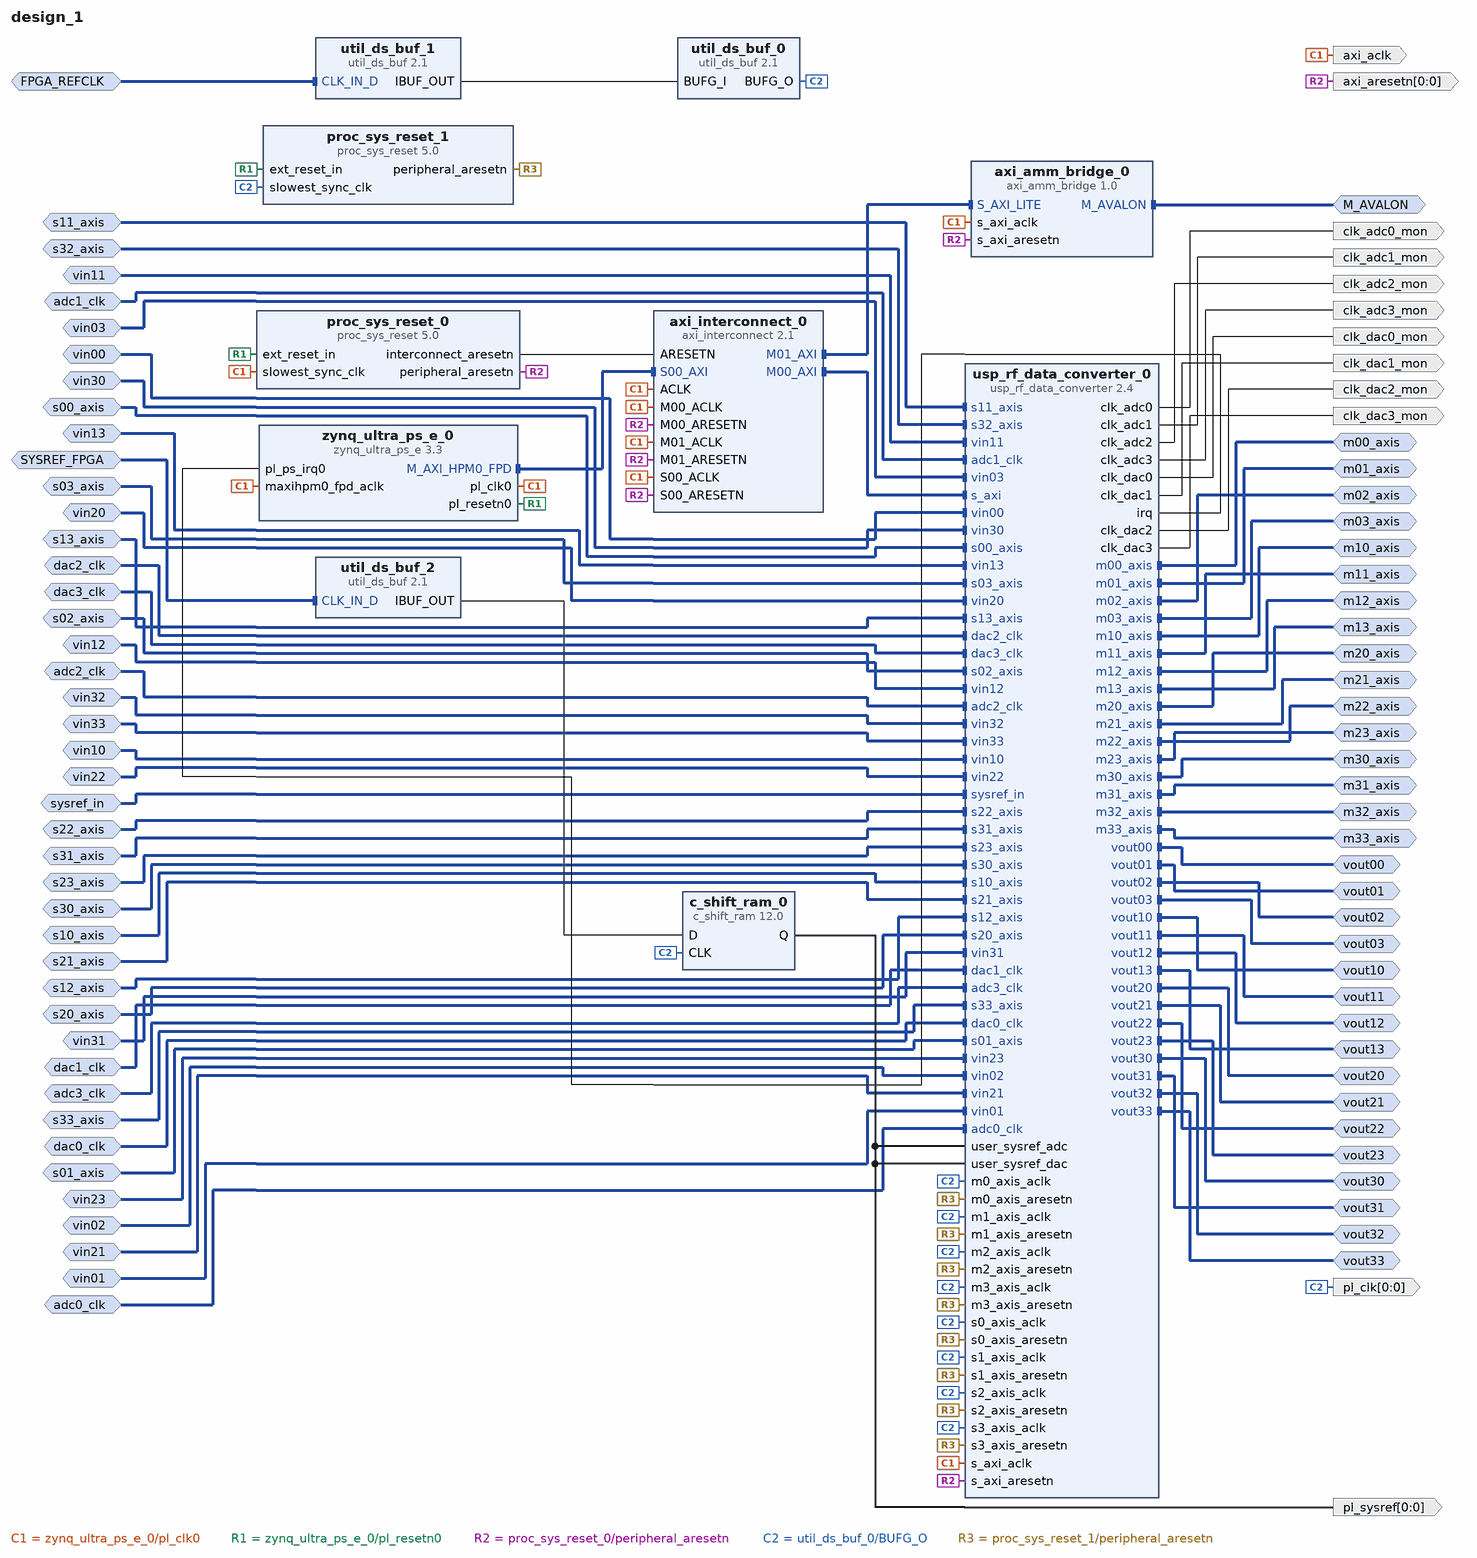
[diagram p0: block diagram of the top level]
# Vivado block design design_1, xczu49dr-ffvf1760-1-e, Vivado 2020.2
create_bd_design design_1

create_bd_intf_port -mode Master -vlnv xilinx.com:interface:avalon_rtl:1.0 M_AVALON
create_bd_intf_port -mode Master -vlnv xilinx.com:interface:diff_analog_io_rtl:1.0 vout00
create_bd_intf_port -mode Master -vlnv xilinx.com:interface:diff_analog_io_rtl:1.0 vout01
create_bd_intf_port -mode Master -vlnv xilinx.com:interface:diff_analog_io_rtl:1.0 vout02
create_bd_intf_port -mode Master -vlnv xilinx.com:interface:diff_analog_io_rtl:1.0 vout03
create_bd_intf_port -mode Master -vlnv xilinx.com:interface:diff_analog_io_rtl:1.0 vout10
create_bd_intf_port -mode Master -vlnv xilinx.com:interface:diff_analog_io_rtl:1.0 vout11
create_bd_intf_port -mode Master -vlnv xilinx.com:interface:diff_analog_io_rtl:1.0 vout12
create_bd_intf_port -mode Master -vlnv xilinx.com:interface:diff_analog_io_rtl:1.0 vout13
create_bd_intf_port -mode Master -vlnv xilinx.com:interface:diff_analog_io_rtl:1.0 vout20
create_bd_intf_port -mode Master -vlnv xilinx.com:interface:diff_analog_io_rtl:1.0 vout21
create_bd_intf_port -mode Master -vlnv xilinx.com:interface:diff_analog_io_rtl:1.0 vout22
create_bd_intf_port -mode Master -vlnv xilinx.com:interface:diff_analog_io_rtl:1.0 vout23
create_bd_intf_port -mode Master -vlnv xilinx.com:interface:diff_analog_io_rtl:1.0 vout30
create_bd_intf_port -mode Master -vlnv xilinx.com:interface:diff_analog_io_rtl:1.0 vout31
create_bd_intf_port -mode Master -vlnv xilinx.com:interface:diff_analog_io_rtl:1.0 vout32
create_bd_intf_port -mode Master -vlnv xilinx.com:interface:diff_analog_io_rtl:1.0 vout33
create_bd_intf_port -mode Slave -vlnv xilinx.com:interface:diff_clock_rtl:1.0 adc0_clk
create_bd_intf_port -mode Slave -vlnv xilinx.com:interface:diff_clock_rtl:1.0 adc1_clk
create_bd_intf_port -mode Slave -vlnv xilinx.com:interface:diff_clock_rtl:1.0 adc2_clk
create_bd_intf_port -mode Slave -vlnv xilinx.com:interface:diff_clock_rtl:1.0 adc3_clk
create_bd_intf_port -mode Slave -vlnv xilinx.com:interface:diff_clock_rtl:1.0 dac0_clk
create_bd_intf_port -mode Slave -vlnv xilinx.com:interface:diff_clock_rtl:1.0 dac1_clk
create_bd_intf_port -mode Slave -vlnv xilinx.com:interface:diff_clock_rtl:1.0 dac2_clk
create_bd_intf_port -mode Slave -vlnv xilinx.com:interface:diff_clock_rtl:1.0 dac3_clk
create_bd_intf_port -mode Slave -vlnv xilinx.com:interface:diff_analog_io_rtl:1.0 vin00
create_bd_intf_port -mode Slave -vlnv xilinx.com:interface:diff_analog_io_rtl:1.0 vin01
create_bd_intf_port -mode Slave -vlnv xilinx.com:interface:diff_analog_io_rtl:1.0 vin02
create_bd_intf_port -mode Slave -vlnv xilinx.com:interface:diff_analog_io_rtl:1.0 vin03
create_bd_intf_port -mode Slave -vlnv xilinx.com:interface:diff_analog_io_rtl:1.0 vin10
create_bd_intf_port -mode Slave -vlnv xilinx.com:interface:diff_analog_io_rtl:1.0 vin11
create_bd_intf_port -mode Slave -vlnv xilinx.com:interface:diff_analog_io_rtl:1.0 vin12
create_bd_intf_port -mode Slave -vlnv xilinx.com:interface:diff_analog_io_rtl:1.0 vin13
create_bd_intf_port -mode Slave -vlnv xilinx.com:interface:diff_analog_io_rtl:1.0 vin20
create_bd_intf_port -mode Slave -vlnv xilinx.com:interface:diff_analog_io_rtl:1.0 vin21
create_bd_intf_port -mode Slave -vlnv xilinx.com:interface:diff_analog_io_rtl:1.0 vin22
create_bd_intf_port -mode Slave -vlnv xilinx.com:interface:diff_analog_io_rtl:1.0 vin23
create_bd_intf_port -mode Slave -vlnv xilinx.com:interface:diff_analog_io_rtl:1.0 vin30
create_bd_intf_port -mode Slave -vlnv xilinx.com:interface:diff_analog_io_rtl:1.0 vin31
create_bd_intf_port -mode Slave -vlnv xilinx.com:interface:diff_analog_io_rtl:1.0 vin32
create_bd_intf_port -mode Slave -vlnv xilinx.com:interface:diff_analog_io_rtl:1.0 vin33
create_bd_intf_port -mode Slave -vlnv xilinx.com:display_usp_rf_data_converter:diff_pins_rtl:1.0 sysref_in
create_bd_intf_port -mode Slave -vlnv xilinx.com:interface:diff_clock_rtl:1.0 FPGA_REFCLK
set_property -dict {CONFIG.FREQ_HZ 245760000} [get_bd_intf_ports FPGA_REFCLK]
create_bd_intf_port -mode Slave -vlnv xilinx.com:interface:diff_clock_rtl:1.0 SYSREF_FPGA
create_bd_intf_port -mode Master -vlnv xilinx.com:interface:axis_rtl:1.0 m00_axis
set_property -dict {CONFIG.FREQ_HZ 245760000} [get_bd_intf_ports m00_axis]
create_bd_intf_port -mode Master -vlnv xilinx.com:interface:axis_rtl:1.0 m01_axis
set_property -dict {CONFIG.FREQ_HZ 245760000} [get_bd_intf_ports m01_axis]
create_bd_intf_port -mode Master -vlnv xilinx.com:interface:axis_rtl:1.0 m02_axis
set_property -dict {CONFIG.FREQ_HZ 245760000} [get_bd_intf_ports m02_axis]
create_bd_intf_port -mode Master -vlnv xilinx.com:interface:axis_rtl:1.0 m03_axis
set_property -dict {CONFIG.FREQ_HZ 245760000} [get_bd_intf_ports m03_axis]
create_bd_intf_port -mode Master -vlnv xilinx.com:interface:axis_rtl:1.0 m10_axis
set_property -dict {CONFIG.FREQ_HZ 245760000} [get_bd_intf_ports m10_axis]
create_bd_intf_port -mode Master -vlnv xilinx.com:interface:axis_rtl:1.0 m11_axis
set_property -dict {CONFIG.FREQ_HZ 245760000} [get_bd_intf_ports m11_axis]
create_bd_intf_port -mode Master -vlnv xilinx.com:interface:axis_rtl:1.0 m12_axis
set_property -dict {CONFIG.FREQ_HZ 245760000} [get_bd_intf_ports m12_axis]
create_bd_intf_port -mode Master -vlnv xilinx.com:interface:axis_rtl:1.0 m13_axis
set_property -dict {CONFIG.FREQ_HZ 245760000} [get_bd_intf_ports m13_axis]
create_bd_intf_port -mode Master -vlnv xilinx.com:interface:axis_rtl:1.0 m20_axis
set_property -dict {CONFIG.FREQ_HZ 245760000} [get_bd_intf_ports m20_axis]
create_bd_intf_port -mode Master -vlnv xilinx.com:interface:axis_rtl:1.0 m21_axis
set_property -dict {CONFIG.FREQ_HZ 245760000} [get_bd_intf_ports m21_axis]
create_bd_intf_port -mode Master -vlnv xilinx.com:interface:axis_rtl:1.0 m22_axis
set_property -dict {CONFIG.FREQ_HZ 245760000} [get_bd_intf_ports m22_axis]
create_bd_intf_port -mode Master -vlnv xilinx.com:interface:axis_rtl:1.0 m23_axis
set_property -dict {CONFIG.FREQ_HZ 245760000} [get_bd_intf_ports m23_axis]
create_bd_intf_port -mode Master -vlnv xilinx.com:interface:axis_rtl:1.0 m30_axis
set_property -dict {CONFIG.FREQ_HZ 245760000} [get_bd_intf_ports m30_axis]
create_bd_intf_port -mode Master -vlnv xilinx.com:interface:axis_rtl:1.0 m31_axis
set_property -dict {CONFIG.FREQ_HZ 245760000} [get_bd_intf_ports m31_axis]
create_bd_intf_port -mode Master -vlnv xilinx.com:interface:axis_rtl:1.0 m32_axis
set_property -dict {CONFIG.FREQ_HZ 245760000} [get_bd_intf_ports m32_axis]
create_bd_intf_port -mode Master -vlnv xilinx.com:interface:axis_rtl:1.0 m33_axis
set_property -dict {CONFIG.FREQ_HZ 245760000} [get_bd_intf_ports m33_axis]
create_bd_intf_port -mode Slave -vlnv xilinx.com:interface:axis_rtl:1.0 s00_axis
set_property -dict [list \
  CONFIG.FREQ_HZ 245760000 \
  CONFIG.HAS_TKEEP 0 \
  CONFIG.HAS_TLAST 0 \
  CONFIG.HAS_TREADY 1 \
  CONFIG.HAS_TSTRB 0 \
  CONFIG.LAYERED_METADATA undef \
  CONFIG.TDATA_NUM_BYTES 16 \
  CONFIG.TDEST_WIDTH 0 \
  CONFIG.TID_WIDTH 0 \
  CONFIG.TUSER_WIDTH 0 \
] [get_bd_intf_ports s00_axis]
create_bd_intf_port -mode Slave -vlnv xilinx.com:interface:axis_rtl:1.0 s01_axis
set_property -dict [list \
  CONFIG.FREQ_HZ 245760000 \
  CONFIG.HAS_TKEEP 0 \
  CONFIG.HAS_TLAST 0 \
  CONFIG.HAS_TREADY 1 \
  CONFIG.HAS_TSTRB 0 \
  CONFIG.LAYERED_METADATA undef \
  CONFIG.TDATA_NUM_BYTES 16 \
  CONFIG.TDEST_WIDTH 0 \
  CONFIG.TID_WIDTH 0 \
  CONFIG.TUSER_WIDTH 0 \
] [get_bd_intf_ports s01_axis]
create_bd_intf_port -mode Slave -vlnv xilinx.com:interface:axis_rtl:1.0 s02_axis
set_property -dict [list \
  CONFIG.FREQ_HZ 245760000 \
  CONFIG.HAS_TKEEP 0 \
  CONFIG.HAS_TLAST 0 \
  CONFIG.HAS_TREADY 1 \
  CONFIG.HAS_TSTRB 0 \
  CONFIG.LAYERED_METADATA undef \
  CONFIG.TDATA_NUM_BYTES 16 \
  CONFIG.TDEST_WIDTH 0 \
  CONFIG.TID_WIDTH 0 \
  CONFIG.TUSER_WIDTH 0 \
] [get_bd_intf_ports s02_axis]
create_bd_intf_port -mode Slave -vlnv xilinx.com:interface:axis_rtl:1.0 s03_axis
set_property -dict [list \
  CONFIG.FREQ_HZ 245760000 \
  CONFIG.HAS_TKEEP 0 \
  CONFIG.HAS_TLAST 0 \
  CONFIG.HAS_TREADY 1 \
  CONFIG.HAS_TSTRB 0 \
  CONFIG.LAYERED_METADATA undef \
  CONFIG.TDATA_NUM_BYTES 16 \
  CONFIG.TDEST_WIDTH 0 \
  CONFIG.TID_WIDTH 0 \
  CONFIG.TUSER_WIDTH 0 \
] [get_bd_intf_ports s03_axis]
create_bd_intf_port -mode Slave -vlnv xilinx.com:interface:axis_rtl:1.0 s10_axis
set_property -dict [list \
  CONFIG.FREQ_HZ 245760000 \
  CONFIG.HAS_TKEEP 0 \
  CONFIG.HAS_TLAST 0 \
  CONFIG.HAS_TREADY 1 \
  CONFIG.HAS_TSTRB 0 \
  CONFIG.LAYERED_METADATA undef \
  CONFIG.TDATA_NUM_BYTES 16 \
  CONFIG.TDEST_WIDTH 0 \
  CONFIG.TID_WIDTH 0 \
  CONFIG.TUSER_WIDTH 0 \
] [get_bd_intf_ports s10_axis]
create_bd_intf_port -mode Slave -vlnv xilinx.com:interface:axis_rtl:1.0 s11_axis
set_property -dict [list \
  CONFIG.FREQ_HZ 245760000 \
  CONFIG.HAS_TKEEP 0 \
  CONFIG.HAS_TLAST 0 \
  CONFIG.HAS_TREADY 1 \
  CONFIG.HAS_TSTRB 0 \
  CONFIG.LAYERED_METADATA undef \
  CONFIG.TDATA_NUM_BYTES 16 \
  CONFIG.TDEST_WIDTH 0 \
  CONFIG.TID_WIDTH 0 \
  CONFIG.TUSER_WIDTH 0 \
] [get_bd_intf_ports s11_axis]
create_bd_intf_port -mode Slave -vlnv xilinx.com:interface:axis_rtl:1.0 s12_axis
set_property -dict [list \
  CONFIG.FREQ_HZ 245760000 \
  CONFIG.HAS_TKEEP 0 \
  CONFIG.HAS_TLAST 0 \
  CONFIG.HAS_TREADY 1 \
  CONFIG.HAS_TSTRB 0 \
  CONFIG.LAYERED_METADATA undef \
  CONFIG.TDATA_NUM_BYTES 16 \
  CONFIG.TDEST_WIDTH 0 \
  CONFIG.TID_WIDTH 0 \
  CONFIG.TUSER_WIDTH 0 \
] [get_bd_intf_ports s12_axis]
create_bd_intf_port -mode Slave -vlnv xilinx.com:interface:axis_rtl:1.0 s13_axis
set_property -dict [list \
  CONFIG.FREQ_HZ 245760000 \
  CONFIG.HAS_TKEEP 0 \
  CONFIG.HAS_TLAST 0 \
  CONFIG.HAS_TREADY 1 \
  CONFIG.HAS_TSTRB 0 \
  CONFIG.LAYERED_METADATA undef \
  CONFIG.TDATA_NUM_BYTES 16 \
  CONFIG.TDEST_WIDTH 0 \
  CONFIG.TID_WIDTH 0 \
  CONFIG.TUSER_WIDTH 0 \
] [get_bd_intf_ports s13_axis]
create_bd_intf_port -mode Slave -vlnv xilinx.com:interface:axis_rtl:1.0 s20_axis
set_property -dict [list \
  CONFIG.FREQ_HZ 245760000 \
  CONFIG.HAS_TKEEP 0 \
  CONFIG.HAS_TLAST 0 \
  CONFIG.HAS_TREADY 1 \
  CONFIG.HAS_TSTRB 0 \
  CONFIG.LAYERED_METADATA undef \
  CONFIG.TDATA_NUM_BYTES 16 \
  CONFIG.TDEST_WIDTH 0 \
  CONFIG.TID_WIDTH 0 \
  CONFIG.TUSER_WIDTH 0 \
] [get_bd_intf_ports s20_axis]
create_bd_intf_port -mode Slave -vlnv xilinx.com:interface:axis_rtl:1.0 s21_axis
set_property -dict [list \
  CONFIG.FREQ_HZ 245760000 \
  CONFIG.HAS_TKEEP 0 \
  CONFIG.HAS_TLAST 0 \
  CONFIG.HAS_TREADY 1 \
  CONFIG.HAS_TSTRB 0 \
  CONFIG.LAYERED_METADATA undef \
  CONFIG.TDATA_NUM_BYTES 16 \
  CONFIG.TDEST_WIDTH 0 \
  CONFIG.TID_WIDTH 0 \
  CONFIG.TUSER_WIDTH 0 \
] [get_bd_intf_ports s21_axis]
create_bd_intf_port -mode Slave -vlnv xilinx.com:interface:axis_rtl:1.0 s22_axis
set_property -dict [list \
  CONFIG.FREQ_HZ 245760000 \
  CONFIG.HAS_TKEEP 0 \
  CONFIG.HAS_TLAST 0 \
  CONFIG.HAS_TREADY 1 \
  CONFIG.HAS_TSTRB 0 \
  CONFIG.LAYERED_METADATA undef \
  CONFIG.TDATA_NUM_BYTES 16 \
  CONFIG.TDEST_WIDTH 0 \
  CONFIG.TID_WIDTH 0 \
  CONFIG.TUSER_WIDTH 0 \
] [get_bd_intf_ports s22_axis]
create_bd_intf_port -mode Slave -vlnv xilinx.com:interface:axis_rtl:1.0 s23_axis
set_property -dict [list \
  CONFIG.FREQ_HZ 245760000 \
  CONFIG.HAS_TKEEP 0 \
  CONFIG.HAS_TLAST 0 \
  CONFIG.HAS_TREADY 1 \
  CONFIG.HAS_TSTRB 0 \
  CONFIG.LAYERED_METADATA undef \
  CONFIG.TDATA_NUM_BYTES 16 \
  CONFIG.TDEST_WIDTH 0 \
  CONFIG.TID_WIDTH 0 \
  CONFIG.TUSER_WIDTH 0 \
] [get_bd_intf_ports s23_axis]
create_bd_intf_port -mode Slave -vlnv xilinx.com:interface:axis_rtl:1.0 s30_axis
set_property -dict [list \
  CONFIG.FREQ_HZ 245760000 \
  CONFIG.HAS_TKEEP 0 \
  CONFIG.HAS_TLAST 0 \
  CONFIG.HAS_TREADY 1 \
  CONFIG.HAS_TSTRB 0 \
  CONFIG.LAYERED_METADATA undef \
  CONFIG.TDATA_NUM_BYTES 16 \
  CONFIG.TDEST_WIDTH 0 \
  CONFIG.TID_WIDTH 0 \
  CONFIG.TUSER_WIDTH 0 \
] [get_bd_intf_ports s30_axis]
create_bd_intf_port -mode Slave -vlnv xilinx.com:interface:axis_rtl:1.0 s31_axis
set_property -dict [list \
  CONFIG.FREQ_HZ 245760000 \
  CONFIG.HAS_TKEEP 0 \
  CONFIG.HAS_TLAST 0 \
  CONFIG.HAS_TREADY 1 \
  CONFIG.HAS_TSTRB 0 \
  CONFIG.LAYERED_METADATA undef \
  CONFIG.TDATA_NUM_BYTES 16 \
  CONFIG.TDEST_WIDTH 0 \
  CONFIG.TID_WIDTH 0 \
  CONFIG.TUSER_WIDTH 0 \
] [get_bd_intf_ports s31_axis]
create_bd_intf_port -mode Slave -vlnv xilinx.com:interface:axis_rtl:1.0 s32_axis
set_property -dict [list \
  CONFIG.FREQ_HZ 245760000 \
  CONFIG.HAS_TKEEP 0 \
  CONFIG.HAS_TLAST 0 \
  CONFIG.HAS_TREADY 1 \
  CONFIG.HAS_TSTRB 0 \
  CONFIG.LAYERED_METADATA undef \
  CONFIG.TDATA_NUM_BYTES 16 \
  CONFIG.TDEST_WIDTH 0 \
  CONFIG.TID_WIDTH 0 \
  CONFIG.TUSER_WIDTH 0 \
] [get_bd_intf_ports s32_axis]
create_bd_intf_port -mode Slave -vlnv xilinx.com:interface:axis_rtl:1.0 s33_axis
set_property -dict [list \
  CONFIG.FREQ_HZ 245760000 \
  CONFIG.HAS_TKEEP 0 \
  CONFIG.HAS_TLAST 0 \
  CONFIG.HAS_TREADY 1 \
  CONFIG.HAS_TSTRB 0 \
  CONFIG.LAYERED_METADATA undef \
  CONFIG.TDATA_NUM_BYTES 16 \
  CONFIG.TDEST_WIDTH 0 \
  CONFIG.TID_WIDTH 0 \
  CONFIG.TUSER_WIDTH 0 \
] [get_bd_intf_ports s33_axis]
create_bd_port -dir O -type clk axi_aclk
create_bd_port -dir O -from 0 -to 0 -type rst axi_aresetn
create_bd_port -dir O -from 0 -to 0 -type data pl_sysref
create_bd_port -dir O -type clk clk_adc0_mon
set_property -dict {CONFIG.FREQ_HZ 245760000} [get_bd_ports clk_adc0_mon]
create_bd_port -dir O -type clk clk_adc1_mon
set_property -dict {CONFIG.FREQ_HZ 245760000} [get_bd_ports clk_adc1_mon]
create_bd_port -dir O -type clk clk_adc2_mon
set_property -dict {CONFIG.FREQ_HZ 245760000} [get_bd_ports clk_adc2_mon]
create_bd_port -dir O -type clk clk_adc3_mon
set_property -dict {CONFIG.FREQ_HZ 245760000} [get_bd_ports clk_adc3_mon]
create_bd_port -dir O -type clk clk_dac0_mon
set_property -dict {CONFIG.FREQ_HZ 245760000} [get_bd_ports clk_dac0_mon]
create_bd_port -dir O -type clk clk_dac1_mon
set_property -dict {CONFIG.FREQ_HZ 245760000} [get_bd_ports clk_dac1_mon]
create_bd_port -dir O -type clk clk_dac2_mon
set_property -dict {CONFIG.FREQ_HZ 245760000} [get_bd_ports clk_dac2_mon]
create_bd_port -dir O -type clk clk_dac3_mon
set_property -dict {CONFIG.FREQ_HZ 245760000} [get_bd_ports clk_dac3_mon]
create_bd_port -dir O -from 0 -to 0 -type clk pl_clk
set_property -dict {CONFIG.FREQ_HZ 245760000} [get_bd_ports pl_clk]

create_bd_cell -type ip -vlnv xilinx.com:ip:axi_amm_bridge:1.0 axi_amm_bridge_0
set_property -dict {CONFIG.C_HAS_RESPONSE 0 CONFIG.C_USE_BYTEENABLE 0} [get_bd_cells axi_amm_bridge_0]
create_bd_cell -type ip -vlnv xilinx.com:ip:axi_interconnect:2.1 axi_interconnect_0
set_property -dict {CONFIG.NUM_MI 2} [get_bd_cells axi_interconnect_0]
create_bd_cell -type ip -vlnv xilinx.com:ip:proc_sys_reset:5.0 proc_sys_reset_0
create_bd_cell -type ip -vlnv xilinx.com:ip:zynq_ultra_ps_e:3.3 zynq_ultra_ps_e_0
set_property -dict [list \
  CONFIG.CAN0_BOARD_INTERFACE custom \
  CONFIG.CAN1_BOARD_INTERFACE custom \
  CONFIG.CSU_BOARD_INTERFACE custom \
  CONFIG.DP_BOARD_INTERFACE custom \
  CONFIG.GEM0_BOARD_INTERFACE custom \
  CONFIG.GEM1_BOARD_INTERFACE custom \
  CONFIG.GEM2_BOARD_INTERFACE custom \
  CONFIG.GEM3_BOARD_INTERFACE custom \
  CONFIG.GPIO_BOARD_INTERFACE custom \
  CONFIG.IIC0_BOARD_INTERFACE custom \
  CONFIG.IIC1_BOARD_INTERFACE custom \
  CONFIG.NAND_BOARD_INTERFACE custom \
  CONFIG.PCIE_BOARD_INTERFACE custom \
  CONFIG.PJTAG_BOARD_INTERFACE custom \
  CONFIG.PMU_BOARD_INTERFACE custom \
  CONFIG.PSU_BANK_0_IO_STANDARD LVCMOS18 \
  CONFIG.PSU_BANK_1_IO_STANDARD LVCMOS18 \
  CONFIG.PSU_BANK_2_IO_STANDARD LVCMOS18 \
  CONFIG.PSU_BANK_3_IO_STANDARD LVCMOS18 \
  CONFIG.PSU_USB3__DUAL_CLOCK_ENABLE 0 \
  CONFIG.PSU__CAN1__PERIPHERAL__ENABLE 0 \
  CONFIG.PSU__CRF_APB__ACPU_CTRL__FREQMHZ 1200 \
  CONFIG.PSU__CRF_APB__ACPU_CTRL__SRCSEL APLL \
  CONFIG.PSU__CRF_APB__APLL_CTRL__SRCSEL PSS_REF_CLK \
  CONFIG.PSU__CRF_APB__DBG_FPD_CTRL__FREQMHZ 250 \
  CONFIG.PSU__CRF_APB__DBG_FPD_CTRL__SRCSEL IOPLL \
  CONFIG.PSU__CRF_APB__DBG_TRACE_CTRL__FREQMHZ 250 \
  CONFIG.PSU__CRF_APB__DBG_TRACE_CTRL__SRCSEL IOPLL \
  CONFIG.PSU__CRF_APB__DBG_TSTMP_CTRL__FREQMHZ 250 \
  CONFIG.PSU__CRF_APB__DBG_TSTMP_CTRL__SRCSEL IOPLL \
  CONFIG.PSU__CRF_APB__DDR_CTRL__FREQMHZ 800 \
  CONFIG.PSU__CRF_APB__DDR_CTRL__SRCSEL DPLL \
  CONFIG.PSU__CRF_APB__DPDMA_REF_CTRL__FREQMHZ 600 \
  CONFIG.PSU__CRF_APB__DPDMA_REF_CTRL__SRCSEL DPLL \
  CONFIG.PSU__CRF_APB__DPLL_CTRL__SRCSEL PSS_REF_CLK \
  CONFIG.PSU__CRF_APB__DP_AUDIO_REF_CTRL__SRCSEL VPLL \
  CONFIG.PSU__CRF_APB__DP_STC_REF_CTRL__SRCSEL VPLL \
  CONFIG.PSU__CRF_APB__DP_VIDEO_REF_CTRL__SRCSEL DPLL \
  CONFIG.PSU__CRF_APB__GDMA_REF_CTRL__FREQMHZ 600 \
  CONFIG.PSU__CRF_APB__GDMA_REF_CTRL__SRCSEL DPLL \
  CONFIG.PSU__CRF_APB__GPU_REF_CTRL__FREQMHZ 600 \
  CONFIG.PSU__CRF_APB__GPU_REF_CTRL__SRCSEL DPLL \
  CONFIG.PSU__CRF_APB__TOPSW_LSBUS_CTRL__FREQMHZ 100 \
  CONFIG.PSU__CRF_APB__TOPSW_LSBUS_CTRL__SRCSEL IOPLL \
  CONFIG.PSU__CRF_APB__TOPSW_MAIN_CTRL__FREQMHZ 533.333 \
  CONFIG.PSU__CRF_APB__TOPSW_MAIN_CTRL__SRCSEL VPLL \
  CONFIG.PSU__CRF_APB__VPLL_CTRL__SRCSEL PSS_REF_CLK \
  CONFIG.PSU__CRL_APB__ADMA_REF_CTRL__FREQMHZ 500 \
  CONFIG.PSU__CRL_APB__ADMA_REF_CTRL__SRCSEL IOPLL \
  CONFIG.PSU__CRL_APB__CAN1_REF_CTRL__FREQMHZ 100 \
  CONFIG.PSU__CRL_APB__CAN1_REF_CTRL__SRCSEL IOPLL \
  CONFIG.PSU__CRL_APB__CPU_R5_CTRL__FREQMHZ 500 \
  CONFIG.PSU__CRL_APB__CPU_R5_CTRL__SRCSEL IOPLL \
  CONFIG.PSU__CRL_APB__DBG_LPD_CTRL__FREQMHZ 250 \
  CONFIG.PSU__CRL_APB__DBG_LPD_CTRL__SRCSEL IOPLL \
  CONFIG.PSU__CRL_APB__GEM3_REF_CTRL__FREQMHZ 125 \
  CONFIG.PSU__CRL_APB__GEM3_REF_CTRL__SRCSEL IOPLL \
  CONFIG.PSU__CRL_APB__I2C0_REF_CTRL__FREQMHZ 100 \
  CONFIG.PSU__CRL_APB__I2C0_REF_CTRL__SRCSEL IOPLL \
  CONFIG.PSU__CRL_APB__I2C1_REF_CTRL__FREQMHZ 100 \
  CONFIG.PSU__CRL_APB__I2C1_REF_CTRL__SRCSEL IOPLL \
  CONFIG.PSU__CRL_APB__IOPLL_CTRL__SRCSEL PSS_REF_CLK \
  CONFIG.PSU__CRL_APB__IOU_SWITCH_CTRL__FREQMHZ 250 \
  CONFIG.PSU__CRL_APB__IOU_SWITCH_CTRL__SRCSEL IOPLL \
  CONFIG.PSU__CRL_APB__LPD_LSBUS_CTRL__FREQMHZ 100 \
  CONFIG.PSU__CRL_APB__LPD_LSBUS_CTRL__SRCSEL IOPLL \
  CONFIG.PSU__CRL_APB__LPD_SWITCH_CTRL__FREQMHZ 500 \
  CONFIG.PSU__CRL_APB__LPD_SWITCH_CTRL__SRCSEL IOPLL \
  CONFIG.PSU__CRL_APB__PCAP_CTRL__FREQMHZ 200 \
  CONFIG.PSU__CRL_APB__PCAP_CTRL__SRCSEL IOPLL \
  CONFIG.PSU__CRL_APB__PL0_REF_CTRL__FREQMHZ 100 \
  CONFIG.PSU__CRL_APB__PL0_REF_CTRL__SRCSEL IOPLL \
  CONFIG.PSU__CRL_APB__QSPI_REF_CTRL__FREQMHZ 125 \
  CONFIG.PSU__CRL_APB__QSPI_REF_CTRL__SRCSEL IOPLL \
  CONFIG.PSU__CRL_APB__RPLL_CTRL__SRCSEL PSS_REF_CLK \
  CONFIG.PSU__CRL_APB__SDIO1_REF_CTRL__FREQMHZ 200 \
  CONFIG.PSU__CRL_APB__SDIO1_REF_CTRL__SRCSEL IOPLL \
  CONFIG.PSU__CRL_APB__TIMESTAMP_REF_CTRL__FREQMHZ 100 \
  CONFIG.PSU__CRL_APB__TIMESTAMP_REF_CTRL__SRCSEL IOPLL \
  CONFIG.PSU__CRL_APB__UART0_REF_CTRL__FREQMHZ 100 \
  CONFIG.PSU__CRL_APB__UART0_REF_CTRL__SRCSEL IOPLL \
  CONFIG.PSU__CRL_APB__UART1_REF_CTRL__FREQMHZ 100 \
  CONFIG.PSU__CRL_APB__UART1_REF_CTRL__SRCSEL IOPLL \
  CONFIG.PSU__CRL_APB__USB0_BUS_REF_CTRL__FREQMHZ 250 \
  CONFIG.PSU__CRL_APB__USB0_BUS_REF_CTRL__SRCSEL IOPLL \
  CONFIG.PSU__CRL_APB__USB3_DUAL_REF_CTRL__FREQMHZ 20 \
  CONFIG.PSU__CRL_APB__USB3_DUAL_REF_CTRL__SRCSEL IOPLL \
  CONFIG.PSU__CRL_APB__USB3__ENABLE 0 \
  CONFIG.PSU__CSUPMU__PERIPHERAL__VALID 1 \
  CONFIG.PSU__DDRC__BUS_WIDTH {32 Bit} \
  CONFIG.PSU__DDRC__COMPONENTS Components \
  CONFIG.PSU__DDRC__DEVICE_CAPACITY {8192 MBits} \
  CONFIG.PSU__DDRC__DRAM_WIDTH {16 Bits} \
  CONFIG.PSU__DDRC__ECC Disabled \
  CONFIG.PSU__DDRC__MEMORY_TYPE {DDR 4} \
  CONFIG.PSU__DDRC__SPEED_BIN DDR4_2400R \
  CONFIG.PSU__DDR_HIGH_ADDRESS_GUI_ENABLE 0 \
  CONFIG.PSU__DDR__INTERFACE__FREQMHZ 400.000 \
  CONFIG.PSU__DEVICE_TYPE RFSOC \
  CONFIG.PSU__DISPLAYPORT__PERIPHERAL__ENABLE 0 \
  CONFIG.PSU__DLL__ISUSED 1 \
  CONFIG.PSU__ENET0__PERIPHERAL__ENABLE 1 \
  CONFIG.PSU__ENET0__PERIPHERAL__IO {GT Lane0} \
  CONFIG.PSU__ENET3__FIFO__ENABLE 0 \
  CONFIG.PSU__ENET3__GRP_MDIO__ENABLE 0 \
  CONFIG.PSU__ENET3__PERIPHERAL__ENABLE 1 \
  CONFIG.PSU__ENET3__PERIPHERAL__IO {MIO 64 .. 75} \
  CONFIG.PSU__ENET3__PTP__ENABLE 0 \
  CONFIG.PSU__ENET3__TSU__ENABLE 0 \
  CONFIG.PSU__FPGA_PL0_ENABLE 1 \
  CONFIG.PSU__GEM0__REF_CLK_FREQ 125 \
  CONFIG.PSU__GEM0__REF_CLK_SEL {Ref Clk0} \
  CONFIG.PSU__GEM3_COHERENCY 0 \
  CONFIG.PSU__GEM3_ROUTE_THROUGH_FPD 0 \
  CONFIG.PSU__GEM__TSU__ENABLE 0 \
  CONFIG.PSU__GPIO0_MIO__IO {MIO 0 .. 25} \
  CONFIG.PSU__GPIO0_MIO__PERIPHERAL__ENABLE 1 \
  CONFIG.PSU__GPIO1_MIO__IO {MIO 26 .. 51} \
  CONFIG.PSU__GPIO1_MIO__PERIPHERAL__ENABLE 1 \
  CONFIG.PSU__GPIO2_MIO__IO {MIO 52 .. 77} \
  CONFIG.PSU__GPIO2_MIO__PERIPHERAL__ENABLE 1 \
  CONFIG.PSU__GPIO_EMIO_WIDTH 95 \
  CONFIG.PSU__GPIO_EMIO__PERIPHERAL__ENABLE 1 \
  CONFIG.PSU__GPIO_EMIO__PERIPHERAL__IO 95 \
  CONFIG.PSU__GPU_PP0__POWER__ON 0 \
  CONFIG.PSU__GPU_PP1__POWER__ON 0 \
  CONFIG.PSU__I2C0__PERIPHERAL__ENABLE 1 \
  CONFIG.PSU__I2C0__PERIPHERAL__IO {MIO 14 .. 15} \
  CONFIG.PSU__I2C1__PERIPHERAL__ENABLE 1 \
  CONFIG.PSU__I2C1__PERIPHERAL__IO {MIO 16 .. 17} \
  CONFIG.PSU__IOU_SLCR__IOU_TTC_APB_CLK__TTC0_SEL APB \
  CONFIG.PSU__IOU_SLCR__IOU_TTC_APB_CLK__TTC1_SEL APB \
  CONFIG.PSU__IOU_SLCR__IOU_TTC_APB_CLK__TTC2_SEL APB \
  CONFIG.PSU__IOU_SLCR__IOU_TTC_APB_CLK__TTC3_SEL APB \
  CONFIG.PSU__MAXIGP0__DATA_WIDTH 128 \
  CONFIG.PSU__OVERRIDE_HPX_QOS 0 \
  CONFIG.PSU__OVERRIDE__BASIC_CLOCK 0 \
  CONFIG.PSU__PMU_COHERENCY 0 \
  CONFIG.PSU__PMU__AIBACK__ENABLE 0 \
  CONFIG.PSU__PMU__EMIO_GPI__ENABLE 0 \
  CONFIG.PSU__PMU__EMIO_GPO__ENABLE 0 \
  CONFIG.PSU__PMU__GPI0__ENABLE 0 \
  CONFIG.PSU__PMU__GPI1__ENABLE 0 \
  CONFIG.PSU__PMU__GPI2__ENABLE 0 \
  CONFIG.PSU__PMU__GPI3__ENABLE 0 \
  CONFIG.PSU__PMU__GPI4__ENABLE 0 \
  CONFIG.PSU__PMU__GPI5__ENABLE 0 \
  CONFIG.PSU__PMU__GPO0__ENABLE 0 \
  CONFIG.PSU__PMU__GPO1__ENABLE 0 \
  CONFIG.PSU__PMU__GPO2__ENABLE 0 \
  CONFIG.PSU__PMU__GPO3__ENABLE 0 \
  CONFIG.PSU__PMU__GPO4__ENABLE 0 \
  CONFIG.PSU__PMU__GPO5__ENABLE 0 \
  CONFIG.PSU__PMU__PERIPHERAL__ENABLE 1 \
  CONFIG.PSU__PMU__PLERROR__ENABLE 0 \
  CONFIG.PSU__PRESET_APPLIED 0 \
  CONFIG.PSU__PSS_REF_CLK__FREQMHZ 33.333 \
  CONFIG.PSU__QSPI_COHERENCY 0 \
  CONFIG.PSU__QSPI_ROUTE_THROUGH_FPD 0 \
  CONFIG.PSU__QSPI__GRP_FBCLK__ENABLE 1 \
  CONFIG.PSU__QSPI__GRP_FBCLK__IO {MIO 6} \
  CONFIG.PSU__QSPI__PERIPHERAL__DATA_MODE x4 \
  CONFIG.PSU__QSPI__PERIPHERAL__ENABLE 1 \
  CONFIG.PSU__QSPI__PERIPHERAL__IO {MIO 0 .. 12} \
  CONFIG.PSU__QSPI__PERIPHERAL__MODE {Dual Parallel} \
  CONFIG.PSU__SATA__PERIPHERAL__ENABLE 0 \
  CONFIG.PSU__SD1_COHERENCY 0 \
  CONFIG.PSU__SD1_ROUTE_THROUGH_FPD 0 \
  CONFIG.PSU__SD1__DATA_TRANSFER_MODE 8Bit \
  CONFIG.PSU__SD1__GRP_CD__ENABLE 0 \
  CONFIG.PSU__SD1__GRP_POW__ENABLE 0 \
  CONFIG.PSU__SD1__GRP_WP__ENABLE 0 \
  CONFIG.PSU__SD1__PERIPHERAL__ENABLE 1 \
  CONFIG.PSU__SD1__PERIPHERAL__IO {MIO 39 .. 51} \
  CONFIG.PSU__SD1__SLOT_TYPE {SD 3.0} \
  CONFIG.PSU__SWDT0__CLOCK__ENABLE 0 \
  CONFIG.PSU__SWDT0__PERIPHERAL__ENABLE 1 \
  CONFIG.PSU__SWDT0__RESET__ENABLE 0 \
  CONFIG.PSU__SWDT1__CLOCK__ENABLE 0 \
  CONFIG.PSU__SWDT1__PERIPHERAL__ENABLE 1 \
  CONFIG.PSU__SWDT1__RESET__ENABLE 0 \
  CONFIG.PSU__TSU__BUFG_PORT_PAIR 0 \
  CONFIG.PSU__TTC0__CLOCK__ENABLE 0 \
  CONFIG.PSU__TTC0__PERIPHERAL__ENABLE 1 \
  CONFIG.PSU__TTC0__WAVEOUT__ENABLE 0 \
  CONFIG.PSU__TTC1__CLOCK__ENABLE 0 \
  CONFIG.PSU__TTC1__PERIPHERAL__ENABLE 1 \
  CONFIG.PSU__TTC1__WAVEOUT__ENABLE 0 \
  CONFIG.PSU__TTC2__CLOCK__ENABLE 0 \
  CONFIG.PSU__TTC2__PERIPHERAL__ENABLE 1 \
  CONFIG.PSU__TTC2__WAVEOUT__ENABLE 0 \
  CONFIG.PSU__TTC3__CLOCK__ENABLE 0 \
  CONFIG.PSU__TTC3__PERIPHERAL__ENABLE 1 \
  CONFIG.PSU__TTC3__WAVEOUT__ENABLE 0 \
  CONFIG.PSU__UART0__BAUD_RATE 115200 \
  CONFIG.PSU__UART0__MODEM__ENABLE 0 \
  CONFIG.PSU__UART0__PERIPHERAL__ENABLE 1 \
  CONFIG.PSU__UART0__PERIPHERAL__IO {MIO 18 .. 19} \
  CONFIG.PSU__UART1__PERIPHERAL__ENABLE 0 \
  CONFIG.PSU__USB0__PERIPHERAL__ENABLE 0 \
  CONFIG.PSU__USE__IRQ0 1 \
  CONFIG.PSU__USE__M_AXI_GP0 1 \
  CONFIG.PSU__USE__M_AXI_GP1 0 \
  CONFIG.PSU__USE__M_AXI_GP2 0 \
  CONFIG.QSPI_BOARD_INTERFACE custom \
  CONFIG.SATA_BOARD_INTERFACE custom \
  CONFIG.SD0_BOARD_INTERFACE custom \
  CONFIG.SD1_BOARD_INTERFACE custom \
  CONFIG.SPI0_BOARD_INTERFACE custom \
  CONFIG.SPI1_BOARD_INTERFACE custom \
  CONFIG.SUBPRESET1 Custom \
  CONFIG.SUBPRESET2 Custom \
  CONFIG.SWDT0_BOARD_INTERFACE custom \
  CONFIG.SWDT1_BOARD_INTERFACE custom \
  CONFIG.TRACE_BOARD_INTERFACE custom \
  CONFIG.TTC0_BOARD_INTERFACE custom \
  CONFIG.TTC1_BOARD_INTERFACE custom \
  CONFIG.TTC2_BOARD_INTERFACE custom \
  CONFIG.TTC3_BOARD_INTERFACE custom \
  CONFIG.UART0_BOARD_INTERFACE custom \
  CONFIG.UART1_BOARD_INTERFACE custom \
  CONFIG.USB0_BOARD_INTERFACE custom \
  CONFIG.USB1_BOARD_INTERFACE custom \
] [get_bd_cells zynq_ultra_ps_e_0]
# 779 more settings of zynq_ultra_ps_e_0 are not shown: defaults, MIO pin electricals, DDR timing, and values the tool derives
create_bd_cell -type ip -vlnv xilinx.com:ip:usp_rf_data_converter:2.4 usp_rf_data_converter_0
set_property -dict [list \
  CONFIG.ADC0_Multi_Tile_Sync true \
  CONFIG.ADC0_Outclk_Freq 245.760 \
  CONFIG.ADC0_PLL_Enable true \
  CONFIG.ADC0_Refclk_Freq 245.760 \
  CONFIG.ADC0_Sampling_Rate 1.96608 \
  CONFIG.ADC1_Multi_Tile_Sync true \
  CONFIG.ADC1_Outclk_Freq 245.760 \
  CONFIG.ADC1_PLL_Enable true \
  CONFIG.ADC1_Refclk_Freq 245.760 \
  CONFIG.ADC1_Sampling_Rate 1.96608 \
  CONFIG.ADC224_En true \
  CONFIG.ADC225_En true \
  CONFIG.ADC226_En true \
  CONFIG.ADC227_En true \
  CONFIG.ADC2_Multi_Tile_Sync true \
  CONFIG.ADC2_Outclk_Freq 245.760 \
  CONFIG.ADC2_PLL_Enable true \
  CONFIG.ADC2_Refclk_Freq 245.760 \
  CONFIG.ADC2_Sampling_Rate 1.96608 \
  CONFIG.ADC3_Multi_Tile_Sync true \
  CONFIG.ADC3_Outclk_Freq 245.760 \
  CONFIG.ADC3_PLL_Enable true \
  CONFIG.ADC3_Refclk_Freq 245.760 \
  CONFIG.ADC3_Sampling_Rate 1.96608 \
  CONFIG.ADC_Coarse_Mixer_Freq00 3 \
  CONFIG.ADC_Coarse_Mixer_Freq01 3 \
  CONFIG.ADC_Coarse_Mixer_Freq02 3 \
  CONFIG.ADC_Coarse_Mixer_Freq03 3 \
  CONFIG.ADC_Coarse_Mixer_Freq10 3 \
  CONFIG.ADC_Coarse_Mixer_Freq11 3 \
  CONFIG.ADC_Coarse_Mixer_Freq12 3 \
  CONFIG.ADC_Coarse_Mixer_Freq13 3 \
  CONFIG.ADC_Coarse_Mixer_Freq20 3 \
  CONFIG.ADC_Coarse_Mixer_Freq21 3 \
  CONFIG.ADC_Coarse_Mixer_Freq22 3 \
  CONFIG.ADC_Coarse_Mixer_Freq23 3 \
  CONFIG.ADC_Coarse_Mixer_Freq30 3 \
  CONFIG.ADC_Coarse_Mixer_Freq31 3 \
  CONFIG.ADC_Coarse_Mixer_Freq32 3 \
  CONFIG.ADC_Coarse_Mixer_Freq33 3 \
  CONFIG.ADC_Decimation_Mode00 1 \
  CONFIG.ADC_Decimation_Mode01 1 \
  CONFIG.ADC_Decimation_Mode02 1 \
  CONFIG.ADC_Decimation_Mode03 1 \
  CONFIG.ADC_Decimation_Mode10 1 \
  CONFIG.ADC_Decimation_Mode11 1 \
  CONFIG.ADC_Decimation_Mode12 1 \
  CONFIG.ADC_Decimation_Mode13 1 \
  CONFIG.ADC_Decimation_Mode20 1 \
  CONFIG.ADC_Decimation_Mode21 1 \
  CONFIG.ADC_Decimation_Mode22 1 \
  CONFIG.ADC_Decimation_Mode23 1 \
  CONFIG.ADC_Decimation_Mode30 1 \
  CONFIG.ADC_Decimation_Mode31 1 \
  CONFIG.ADC_Decimation_Mode32 1 \
  CONFIG.ADC_Decimation_Mode33 1 \
  CONFIG.ADC_Mixer_Type00 1 \
  CONFIG.ADC_Mixer_Type01 1 \
  CONFIG.ADC_Mixer_Type02 1 \
  CONFIG.ADC_Mixer_Type03 1 \
  CONFIG.ADC_Mixer_Type10 1 \
  CONFIG.ADC_Mixer_Type11 1 \
  CONFIG.ADC_Mixer_Type12 1 \
  CONFIG.ADC_Mixer_Type13 1 \
  CONFIG.ADC_Mixer_Type20 1 \
  CONFIG.ADC_Mixer_Type21 1 \
  CONFIG.ADC_Mixer_Type22 1 \
  CONFIG.ADC_Mixer_Type23 1 \
  CONFIG.ADC_Mixer_Type30 1 \
  CONFIG.ADC_Mixer_Type31 1 \
  CONFIG.ADC_Mixer_Type32 1 \
  CONFIG.ADC_Mixer_Type33 1 \
  CONFIG.ADC_OBS01 false \
  CONFIG.ADC_OBS02 false \
  CONFIG.ADC_OBS03 false \
  CONFIG.ADC_OBS11 false \
  CONFIG.ADC_OBS12 false \
  CONFIG.ADC_OBS13 false \
  CONFIG.ADC_OBS21 false \
  CONFIG.ADC_OBS22 false \
  CONFIG.ADC_OBS23 false \
  CONFIG.ADC_OBS31 false \
  CONFIG.ADC_OBS32 false \
  CONFIG.ADC_OBS33 false \
  CONFIG.ADC_Slice00_Enable true \
  CONFIG.ADC_Slice01_Enable true \
  CONFIG.ADC_Slice02_Enable true \
  CONFIG.ADC_Slice03_Enable true \
  CONFIG.ADC_Slice10_Enable true \
  CONFIG.ADC_Slice11_Enable true \
  CONFIG.ADC_Slice12_Enable true \
  CONFIG.ADC_Slice13_Enable true \
  CONFIG.ADC_Slice20_Enable true \
  CONFIG.ADC_Slice21_Enable true \
  CONFIG.ADC_Slice22_Enable true \
  CONFIG.ADC_Slice23_Enable true \
  CONFIG.ADC_Slice30_Enable true \
  CONFIG.ADC_Slice31_Enable true \
  CONFIG.ADC_Slice32_Enable true \
  CONFIG.ADC_Slice33_Enable true \
  CONFIG.Converter_Setup 1 \
  CONFIG.DAC0_Multi_Tile_Sync true \
  CONFIG.DAC0_Outclk_Freq 245.760 \
  CONFIG.DAC0_PLL_Enable true \
  CONFIG.DAC0_Refclk_Freq 245.760 \
  CONFIG.DAC0_Sampling_Rate 1.96608 \
  CONFIG.DAC1_Multi_Tile_Sync true \
  CONFIG.DAC1_Outclk_Freq 245.760 \
  CONFIG.DAC1_PLL_Enable true \
  CONFIG.DAC1_Refclk_Freq 245.760 \
  CONFIG.DAC1_Sampling_Rate 1.96608 \
  CONFIG.DAC228_En true \
  CONFIG.DAC229_En true \
  CONFIG.DAC230_En true \
  CONFIG.DAC231_En true \
  CONFIG.DAC2_Multi_Tile_Sync true \
  CONFIG.DAC2_Outclk_Freq 245.760 \
  CONFIG.DAC2_PLL_Enable true \
  CONFIG.DAC2_Refclk_Freq 245.760 \
  CONFIG.DAC2_Sampling_Rate 1.96608 \
  CONFIG.DAC3_Multi_Tile_Sync true \
  CONFIG.DAC3_Outclk_Freq 245.760 \
  CONFIG.DAC3_PLL_Enable true \
  CONFIG.DAC3_Refclk_Freq 245.760 \
  CONFIG.DAC3_Sampling_Rate 1.96608 \
  CONFIG.DAC_Coarse_Mixer_Freq00 3 \
  CONFIG.DAC_Coarse_Mixer_Freq01 3 \
  CONFIG.DAC_Coarse_Mixer_Freq02 3 \
  CONFIG.DAC_Coarse_Mixer_Freq03 3 \
  CONFIG.DAC_Coarse_Mixer_Freq10 3 \
  CONFIG.DAC_Coarse_Mixer_Freq11 3 \
  CONFIG.DAC_Coarse_Mixer_Freq12 3 \
  CONFIG.DAC_Coarse_Mixer_Freq13 3 \
  CONFIG.DAC_Coarse_Mixer_Freq20 3 \
  CONFIG.DAC_Coarse_Mixer_Freq21 3 \
  CONFIG.DAC_Coarse_Mixer_Freq22 3 \
  CONFIG.DAC_Coarse_Mixer_Freq23 3 \
  CONFIG.DAC_Coarse_Mixer_Freq30 3 \
  CONFIG.DAC_Coarse_Mixer_Freq31 3 \
  CONFIG.DAC_Coarse_Mixer_Freq32 3 \
  CONFIG.DAC_Coarse_Mixer_Freq33 3 \
  CONFIG.DAC_Data_Width00 8 \
  CONFIG.DAC_Data_Width01 8 \
  CONFIG.DAC_Data_Width02 8 \
  CONFIG.DAC_Data_Width03 8 \
  CONFIG.DAC_Data_Width10 8 \
  CONFIG.DAC_Data_Width11 8 \
  CONFIG.DAC_Data_Width12 8 \
  CONFIG.DAC_Data_Width13 8 \
  CONFIG.DAC_Data_Width20 8 \
  CONFIG.DAC_Data_Width21 8 \
  CONFIG.DAC_Data_Width22 8 \
  CONFIG.DAC_Data_Width23 8 \
  CONFIG.DAC_Data_Width30 8 \
  CONFIG.DAC_Data_Width31 8 \
  CONFIG.DAC_Data_Width32 8 \
  CONFIG.DAC_Data_Width33 8 \
  CONFIG.DAC_Interpolation_Mode00 1 \
  CONFIG.DAC_Interpolation_Mode01 1 \
  CONFIG.DAC_Interpolation_Mode02 1 \
  CONFIG.DAC_Interpolation_Mode03 1 \
  CONFIG.DAC_Interpolation_Mode10 1 \
  CONFIG.DAC_Interpolation_Mode11 1 \
  CONFIG.DAC_Interpolation_Mode12 1 \
  CONFIG.DAC_Interpolation_Mode13 1 \
  CONFIG.DAC_Interpolation_Mode20 1 \
  CONFIG.DAC_Interpolation_Mode21 1 \
  CONFIG.DAC_Interpolation_Mode22 1 \
  CONFIG.DAC_Interpolation_Mode23 1 \
  CONFIG.DAC_Interpolation_Mode30 1 \
  CONFIG.DAC_Interpolation_Mode31 1 \
  CONFIG.DAC_Interpolation_Mode32 1 \
  CONFIG.DAC_Interpolation_Mode33 1 \
  CONFIG.DAC_Mixer_Mode00 2 \
  CONFIG.DAC_Mixer_Mode01 2 \
  CONFIG.DAC_Mixer_Mode03 2 \
  CONFIG.DAC_Mixer_Mode10 2 \
  CONFIG.DAC_Mixer_Mode11 2 \
  CONFIG.DAC_Mixer_Mode13 2 \
  CONFIG.DAC_Mixer_Mode20 2 \
  CONFIG.DAC_Mixer_Mode21 2 \
  CONFIG.DAC_Mixer_Mode30 2 \
  CONFIG.DAC_Mixer_Mode31 2 \
  CONFIG.DAC_Mixer_Type00 1 \
  CONFIG.DAC_Mixer_Type01 1 \
  CONFIG.DAC_Mixer_Type02 1 \
  CONFIG.DAC_Mixer_Type03 1 \
  CONFIG.DAC_Mixer_Type10 1 \
  CONFIG.DAC_Mixer_Type11 1 \
  CONFIG.DAC_Mixer_Type12 1 \
  CONFIG.DAC_Mixer_Type13 1 \
  CONFIG.DAC_Mixer_Type20 1 \
  CONFIG.DAC_Mixer_Type21 1 \
  CONFIG.DAC_Mixer_Type22 1 \
  CONFIG.DAC_Mixer_Type23 1 \
  CONFIG.DAC_Mixer_Type30 1 \
  CONFIG.DAC_Mixer_Type31 1 \
  CONFIG.DAC_Mixer_Type32 1 \
  CONFIG.DAC_Mixer_Type33 1 \
  CONFIG.DAC_Slice00_Enable true \
  CONFIG.DAC_Slice01_Enable true \
  CONFIG.DAC_Slice02_Enable true \
  CONFIG.DAC_Slice03_Enable true \
  CONFIG.DAC_Slice10_Enable true \
  CONFIG.DAC_Slice11_Enable true \
  CONFIG.DAC_Slice12_Enable true \
  CONFIG.DAC_Slice13_Enable true \
  CONFIG.DAC_Slice20_Enable true \
  CONFIG.DAC_Slice21_Enable true \
  CONFIG.DAC_Slice22_Enable true \
  CONFIG.DAC_Slice23_Enable true \
  CONFIG.DAC_Slice30_Enable true \
  CONFIG.DAC_Slice31_Enable true \
  CONFIG.DAC_Slice32_Enable true \
  CONFIG.DAC_Slice33_Enable true \
] [get_bd_cells usp_rf_data_converter_0]
create_bd_cell -type ip -vlnv xilinx.com:ip:util_ds_buf:2.1 util_ds_buf_0
set_property -dict {CONFIG.C_BUF_TYPE BUFG} [get_bd_cells util_ds_buf_0]
create_bd_cell -type ip -vlnv xilinx.com:ip:util_ds_buf:2.1 util_ds_buf_1
create_bd_cell -type ip -vlnv xilinx.com:ip:proc_sys_reset:5.0 proc_sys_reset_1
create_bd_cell -type ip -vlnv xilinx.com:ip:c_shift_ram:12.0 c_shift_ram_0
set_property -dict {CONFIG.AsyncInitVal 0 CONFIG.DefaultData 0 CONFIG.Depth 1 CONFIG.Width 1} [get_bd_cells c_shift_ram_0]
create_bd_cell -type ip -vlnv xilinx.com:ip:util_ds_buf:2.1 util_ds_buf_2

# ---- connections ----

connect_bd_intf_net [get_bd_intf_pins axi_interconnect_0/M00_AXI] [get_bd_intf_pins usp_rf_data_converter_0/s_axi]
connect_bd_intf_net [get_bd_intf_ports m13_axis] [get_bd_intf_pins usp_rf_data_converter_0/m13_axis]
connect_bd_intf_net [get_bd_intf_ports M_AVALON] [get_bd_intf_pins axi_amm_bridge_0/M_AVALON]
connect_bd_intf_net -intf_net CLK_IN_D_0_2 [get_bd_intf_ports SYSREF_FPGA] [get_bd_intf_pins util_ds_buf_2/CLK_IN_D]
connect_bd_intf_net -intf_net s11_axis_0_1 [get_bd_intf_ports s11_axis] [get_bd_intf_pins usp_rf_data_converter_0/s11_axis]
connect_bd_intf_net [get_bd_intf_ports m21_axis] [get_bd_intf_pins usp_rf_data_converter_0/m21_axis]
connect_bd_intf_net [get_bd_intf_pins zynq_ultra_ps_e_0/M_AXI_HPM0_FPD] [get_bd_intf_pins axi_interconnect_0/S00_AXI]
connect_bd_intf_net [get_bd_intf_pins axi_interconnect_0/M01_AXI] [get_bd_intf_pins axi_amm_bridge_0/S_AXI_LITE]
connect_bd_intf_net [get_bd_intf_ports m12_axis] [get_bd_intf_pins usp_rf_data_converter_0/m12_axis]
connect_bd_intf_net -intf_net CLK_IN_D_0_1 [get_bd_intf_ports FPGA_REFCLK] [get_bd_intf_pins util_ds_buf_1/CLK_IN_D]
connect_bd_intf_net -intf_net s32_axis_0_1 [get_bd_intf_ports s32_axis] [get_bd_intf_pins usp_rf_data_converter_0/s32_axis]
connect_bd_intf_net [get_bd_intf_ports vout23] [get_bd_intf_pins usp_rf_data_converter_0/vout23]
connect_bd_intf_net [get_bd_intf_ports vout10] [get_bd_intf_pins usp_rf_data_converter_0/vout10]
connect_bd_intf_net [get_bd_intf_ports vout01] [get_bd_intf_pins usp_rf_data_converter_0/vout01]
connect_bd_intf_net [get_bd_intf_ports vout02] [get_bd_intf_pins usp_rf_data_converter_0/vout02]
connect_bd_intf_net -intf_net vin11_0_1 [get_bd_intf_ports vin11] [get_bd_intf_pins usp_rf_data_converter_0/vin11]
connect_bd_intf_net [get_bd_intf_ports m03_axis] [get_bd_intf_pins usp_rf_data_converter_0/m03_axis]
connect_bd_intf_net [get_bd_intf_ports m10_axis] [get_bd_intf_pins usp_rf_data_converter_0/m10_axis]
connect_bd_intf_net -intf_net adc1_clk_0_1 [get_bd_intf_ports adc1_clk] [get_bd_intf_pins usp_rf_data_converter_0/adc1_clk]
connect_bd_intf_net -intf_net vin03_0_1 [get_bd_intf_ports vin03] [get_bd_intf_pins usp_rf_data_converter_0/vin03]
connect_bd_intf_net -intf_net vin00_0_1 [get_bd_intf_ports vin00] [get_bd_intf_pins usp_rf_data_converter_0/vin00]
connect_bd_intf_net [get_bd_intf_ports m23_axis] [get_bd_intf_pins usp_rf_data_converter_0/m23_axis]
connect_bd_intf_net -intf_net vin30_0_1 [get_bd_intf_ports vin30] [get_bd_intf_pins usp_rf_data_converter_0/vin30]
connect_bd_intf_net -intf_net s00_axis_0_1 [get_bd_intf_ports s00_axis] [get_bd_intf_pins usp_rf_data_converter_0/s00_axis]
connect_bd_intf_net [get_bd_intf_ports m31_axis] [get_bd_intf_pins usp_rf_data_converter_0/m31_axis]
connect_bd_intf_net -intf_net vin13_0_1 [get_bd_intf_ports vin13] [get_bd_intf_pins usp_rf_data_converter_0/vin13]
connect_bd_intf_net [get_bd_intf_ports vout32] [get_bd_intf_pins usp_rf_data_converter_0/vout32]
connect_bd_intf_net [get_bd_intf_ports vout20] [get_bd_intf_pins usp_rf_data_converter_0/vout20]
connect_bd_intf_net [get_bd_intf_ports vout11] [get_bd_intf_pins usp_rf_data_converter_0/vout11]
connect_bd_intf_net [get_bd_intf_ports vout12] [get_bd_intf_pins usp_rf_data_converter_0/vout12]
connect_bd_intf_net [get_bd_intf_ports m33_axis] [get_bd_intf_pins usp_rf_data_converter_0/m33_axis]
connect_bd_intf_net -intf_net s03_axis_0_1 [get_bd_intf_ports s03_axis] [get_bd_intf_pins usp_rf_data_converter_0/s03_axis]
connect_bd_intf_net -intf_net vin20_0_1 [get_bd_intf_ports vin20] [get_bd_intf_pins usp_rf_data_converter_0/vin20]
connect_bd_intf_net -intf_net s13_axis_0_1 [get_bd_intf_ports s13_axis] [get_bd_intf_pins usp_rf_data_converter_0/s13_axis]
connect_bd_intf_net -intf_net dac2_clk_0_1 [get_bd_intf_ports dac2_clk] [get_bd_intf_pins usp_rf_data_converter_0/dac2_clk]
connect_bd_intf_net -intf_net dac3_clk_0_1 [get_bd_intf_ports dac3_clk] [get_bd_intf_pins usp_rf_data_converter_0/dac3_clk]
connect_bd_intf_net -intf_net s02_axis_0_1 [get_bd_intf_ports s02_axis] [get_bd_intf_pins usp_rf_data_converter_0/s02_axis]
connect_bd_intf_net [get_bd_intf_ports m01_axis] [get_bd_intf_pins usp_rf_data_converter_0/m01_axis]
connect_bd_intf_net -intf_net vin12_0_1 [get_bd_intf_ports vin12] [get_bd_intf_pins usp_rf_data_converter_0/vin12]
connect_bd_intf_net -intf_net adc2_clk_0_1 [get_bd_intf_ports adc2_clk] [get_bd_intf_pins usp_rf_data_converter_0/adc2_clk]
connect_bd_intf_net [get_bd_intf_ports vout22] [get_bd_intf_pins usp_rf_data_converter_0/vout22]
connect_bd_intf_net [get_bd_intf_ports vout13] [get_bd_intf_pins usp_rf_data_converter_0/vout13]
connect_bd_intf_net -intf_net vin32_0_1 [get_bd_intf_ports vin32] [get_bd_intf_pins usp_rf_data_converter_0/vin32]
connect_bd_intf_net -intf_net vin33_0_1 [get_bd_intf_ports vin33] [get_bd_intf_pins usp_rf_data_converter_0/vin33]
connect_bd_intf_net -intf_net vin10_0_1 [get_bd_intf_ports vin10] [get_bd_intf_pins usp_rf_data_converter_0/vin10]
connect_bd_intf_net [get_bd_intf_ports vout30] [get_bd_intf_pins usp_rf_data_converter_0/vout30]
connect_bd_intf_net [get_bd_intf_ports vout21] [get_bd_intf_pins usp_rf_data_converter_0/vout21]
connect_bd_intf_net -intf_net vin22_0_1 [get_bd_intf_ports vin22] [get_bd_intf_pins usp_rf_data_converter_0/vin22]
connect_bd_intf_net -intf_net sysref_in_0_1 [get_bd_intf_ports sysref_in] [get_bd_intf_pins usp_rf_data_converter_0/sysref_in]
connect_bd_intf_net [get_bd_intf_ports vout31] [get_bd_intf_pins usp_rf_data_converter_0/vout31]
connect_bd_intf_net [get_bd_intf_ports m11_axis] [get_bd_intf_pins usp_rf_data_converter_0/m11_axis]
connect_bd_intf_net -intf_net s22_axis_0_1 [get_bd_intf_ports s22_axis] [get_bd_intf_pins usp_rf_data_converter_0/s22_axis]
connect_bd_intf_net -intf_net s31_axis_0_1 [get_bd_intf_ports s31_axis] [get_bd_intf_pins usp_rf_data_converter_0/s31_axis]
connect_bd_intf_net [get_bd_intf_ports m22_axis] [get_bd_intf_pins usp_rf_data_converter_0/m22_axis]
connect_bd_intf_net -intf_net s23_axis_0_1 [get_bd_intf_ports s23_axis] [get_bd_intf_pins usp_rf_data_converter_0/s23_axis]
connect_bd_intf_net -intf_net s30_axis_0_1 [get_bd_intf_ports s30_axis] [get_bd_intf_pins usp_rf_data_converter_0/s30_axis]
connect_bd_intf_net [get_bd_intf_ports m30_axis] [get_bd_intf_pins usp_rf_data_converter_0/m30_axis]
connect_bd_intf_net -intf_net s10_axis_0_1 [get_bd_intf_ports s10_axis] [get_bd_intf_pins usp_rf_data_converter_0/s10_axis]
connect_bd_intf_net -intf_net s21_axis_0_1 [get_bd_intf_ports s21_axis] [get_bd_intf_pins usp_rf_data_converter_0/s21_axis]
connect_bd_intf_net [get_bd_intf_ports vout00] [get_bd_intf_pins usp_rf_data_converter_0/vout00]
connect_bd_intf_net [get_bd_intf_ports m32_axis] [get_bd_intf_pins usp_rf_data_converter_0/m32_axis]
connect_bd_intf_net [get_bd_intf_ports m20_axis] [get_bd_intf_pins usp_rf_data_converter_0/m20_axis]
connect_bd_intf_net [get_bd_intf_ports m02_axis] [get_bd_intf_pins usp_rf_data_converter_0/m02_axis]
connect_bd_intf_net [get_bd_intf_ports vout03] [get_bd_intf_pins usp_rf_data_converter_0/vout03]
connect_bd_intf_net -intf_net s12_axis_0_1 [get_bd_intf_ports s12_axis] [get_bd_intf_pins usp_rf_data_converter_0/s12_axis]
connect_bd_intf_net -intf_net s20_axis_0_1 [get_bd_intf_ports s20_axis] [get_bd_intf_pins usp_rf_data_converter_0/s20_axis]
connect_bd_intf_net -intf_net vin31_0_1 [get_bd_intf_ports vin31] [get_bd_intf_pins usp_rf_data_converter_0/vin31]
connect_bd_intf_net -intf_net dac1_clk_0_1 [get_bd_intf_ports dac1_clk] [get_bd_intf_pins usp_rf_data_converter_0/dac1_clk]
connect_bd_intf_net -intf_net adc3_clk_0_1 [get_bd_intf_ports adc3_clk] [get_bd_intf_pins usp_rf_data_converter_0/adc3_clk]
connect_bd_intf_net -intf_net s33_axis_0_1 [get_bd_intf_ports s33_axis] [get_bd_intf_pins usp_rf_data_converter_0/s33_axis]
connect_bd_intf_net [get_bd_intf_ports vout33] [get_bd_intf_pins usp_rf_data_converter_0/vout33]
connect_bd_intf_net -intf_net dac0_clk_0_1 [get_bd_intf_ports dac0_clk] [get_bd_intf_pins usp_rf_data_converter_0/dac0_clk]
connect_bd_intf_net -intf_net s01_axis_0_1 [get_bd_intf_ports s01_axis] [get_bd_intf_pins usp_rf_data_converter_0/s01_axis]
connect_bd_intf_net -intf_net vin23_0_1 [get_bd_intf_ports vin23] [get_bd_intf_pins usp_rf_data_converter_0/vin23]
connect_bd_intf_net -intf_net vin02_0_1 [get_bd_intf_ports vin02] [get_bd_intf_pins usp_rf_data_converter_0/vin02]
connect_bd_intf_net -intf_net vin21_0_1 [get_bd_intf_ports vin21] [get_bd_intf_pins usp_rf_data_converter_0/vin21]
connect_bd_intf_net -intf_net vin01_0_1 [get_bd_intf_ports vin01] [get_bd_intf_pins usp_rf_data_converter_0/vin01]
connect_bd_intf_net [get_bd_intf_ports m00_axis] [get_bd_intf_pins usp_rf_data_converter_0/m00_axis]
connect_bd_intf_net -intf_net adc0_clk_0_1 [get_bd_intf_ports adc0_clk] [get_bd_intf_pins usp_rf_data_converter_0/adc0_clk]
connect_bd_net -net ACLK_1 [get_bd_pins zynq_ultra_ps_e_0/pl_clk0] \
  [get_bd_ports axi_aclk] [get_bd_pins axi_amm_bridge_0/s_axi_aclk] [get_bd_pins axi_interconnect_0/ACLK] \
  [get_bd_pins axi_interconnect_0/S00_ACLK] [get_bd_pins axi_interconnect_0/M00_ACLK] \
  [get_bd_pins axi_interconnect_0/M01_ACLK] [get_bd_pins proc_sys_reset_0/slowest_sync_clk] \
  [get_bd_pins zynq_ultra_ps_e_0/maxihpm0_fpd_aclk] [get_bd_pins usp_rf_data_converter_0/s_axi_aclk]
connect_bd_net [get_bd_pins zynq_ultra_ps_e_0/pl_resetn0] [get_bd_pins proc_sys_reset_0/ext_reset_in] [get_bd_pins proc_sys_reset_1/ext_reset_in]
connect_bd_net [get_bd_pins proc_sys_reset_0/interconnect_aresetn] [get_bd_pins axi_interconnect_0/ARESETN]
connect_bd_net [get_bd_pins proc_sys_reset_0/peripheral_aresetn] \
  [get_bd_ports axi_aresetn] [get_bd_pins axi_amm_bridge_0/s_axi_aresetn] [get_bd_pins axi_interconnect_0/S00_ARESETN] \
  [get_bd_pins axi_interconnect_0/M00_ARESETN] [get_bd_pins axi_interconnect_0/M01_ARESETN] \
  [get_bd_pins usp_rf_data_converter_0/s_axi_aresetn]
connect_bd_net [get_bd_pins util_ds_buf_0/BUFG_O] \
  [get_bd_pins usp_rf_data_converter_0/m0_axis_aclk] [get_bd_pins usp_rf_data_converter_0/s1_axis_aclk] \
  [get_bd_pins usp_rf_data_converter_0/m1_axis_aclk] [get_bd_pins usp_rf_data_converter_0/m2_axis_aclk] \
  [get_bd_pins usp_rf_data_converter_0/m3_axis_aclk] [get_bd_pins usp_rf_data_converter_0/s0_axis_aclk] \
  [get_bd_pins usp_rf_data_converter_0/s2_axis_aclk] [get_bd_pins usp_rf_data_converter_0/s3_axis_aclk] \
  [get_bd_pins proc_sys_reset_1/slowest_sync_clk] [get_bd_pins c_shift_ram_0/CLK] [get_bd_ports pl_clk]
connect_bd_net [get_bd_pins util_ds_buf_1/IBUF_OUT] [get_bd_pins util_ds_buf_0/BUFG_I]
connect_bd_net [get_bd_pins proc_sys_reset_1/peripheral_aresetn] \
  [get_bd_pins usp_rf_data_converter_0/s3_axis_aresetn] [get_bd_pins usp_rf_data_converter_0/s2_axis_aresetn] \
  [get_bd_pins usp_rf_data_converter_0/s1_axis_aresetn] [get_bd_pins usp_rf_data_converter_0/s0_axis_aresetn] \
  [get_bd_pins usp_rf_data_converter_0/m3_axis_aresetn] [get_bd_pins usp_rf_data_converter_0/m2_axis_aresetn] \
  [get_bd_pins usp_rf_data_converter_0/m1_axis_aresetn] [get_bd_pins usp_rf_data_converter_0/m0_axis_aresetn]
connect_bd_net [get_bd_pins c_shift_ram_0/Q] \
  [get_bd_ports pl_sysref] [get_bd_pins usp_rf_data_converter_0/user_sysref_adc] \
  [get_bd_pins usp_rf_data_converter_0/user_sysref_dac]
connect_bd_net [get_bd_pins util_ds_buf_2/IBUF_OUT] [get_bd_pins c_shift_ram_0/D]
connect_bd_net [get_bd_pins usp_rf_data_converter_0/clk_adc0] [get_bd_ports clk_adc0_mon]
connect_bd_net [get_bd_pins usp_rf_data_converter_0/clk_adc1] [get_bd_ports clk_adc1_mon]
connect_bd_net [get_bd_pins usp_rf_data_converter_0/clk_adc2] [get_bd_ports clk_adc2_mon]
connect_bd_net [get_bd_pins usp_rf_data_converter_0/clk_adc3] [get_bd_ports clk_adc3_mon]
connect_bd_net [get_bd_pins usp_rf_data_converter_0/clk_dac0] [get_bd_ports clk_dac0_mon]
connect_bd_net [get_bd_pins usp_rf_data_converter_0/clk_dac1] [get_bd_ports clk_dac1_mon]
connect_bd_net [get_bd_pins usp_rf_data_converter_0/clk_dac2] [get_bd_ports clk_dac2_mon]
connect_bd_net [get_bd_pins usp_rf_data_converter_0/clk_dac3] [get_bd_ports clk_dac3_mon]
connect_bd_net [get_bd_pins usp_rf_data_converter_0/irq] [get_bd_pins zynq_ultra_ps_e_0/pl_ps_irq0]

# ---- address map ----
assign_bd_address -offset 0x00A0100000 -range 256K -target_address_space [get_bd_addr_spaces zynq_ultra_ps_e_0/Data] [get_bd_addr_segs usp_rf_data_converter_0/s_axi/Reg]
assign_bd_address -offset 0x0400000000 -range 4G -target_address_space [get_bd_addr_spaces zynq_ultra_ps_e_0/Data] [get_bd_addr_segs M_AVALON/Reg]

validate_bd_design
save_bd_design
